# Altium schematic sheet 02_Block diagram.SchDoc
size A3; SheetNumber: 2; SheetTotal: 4
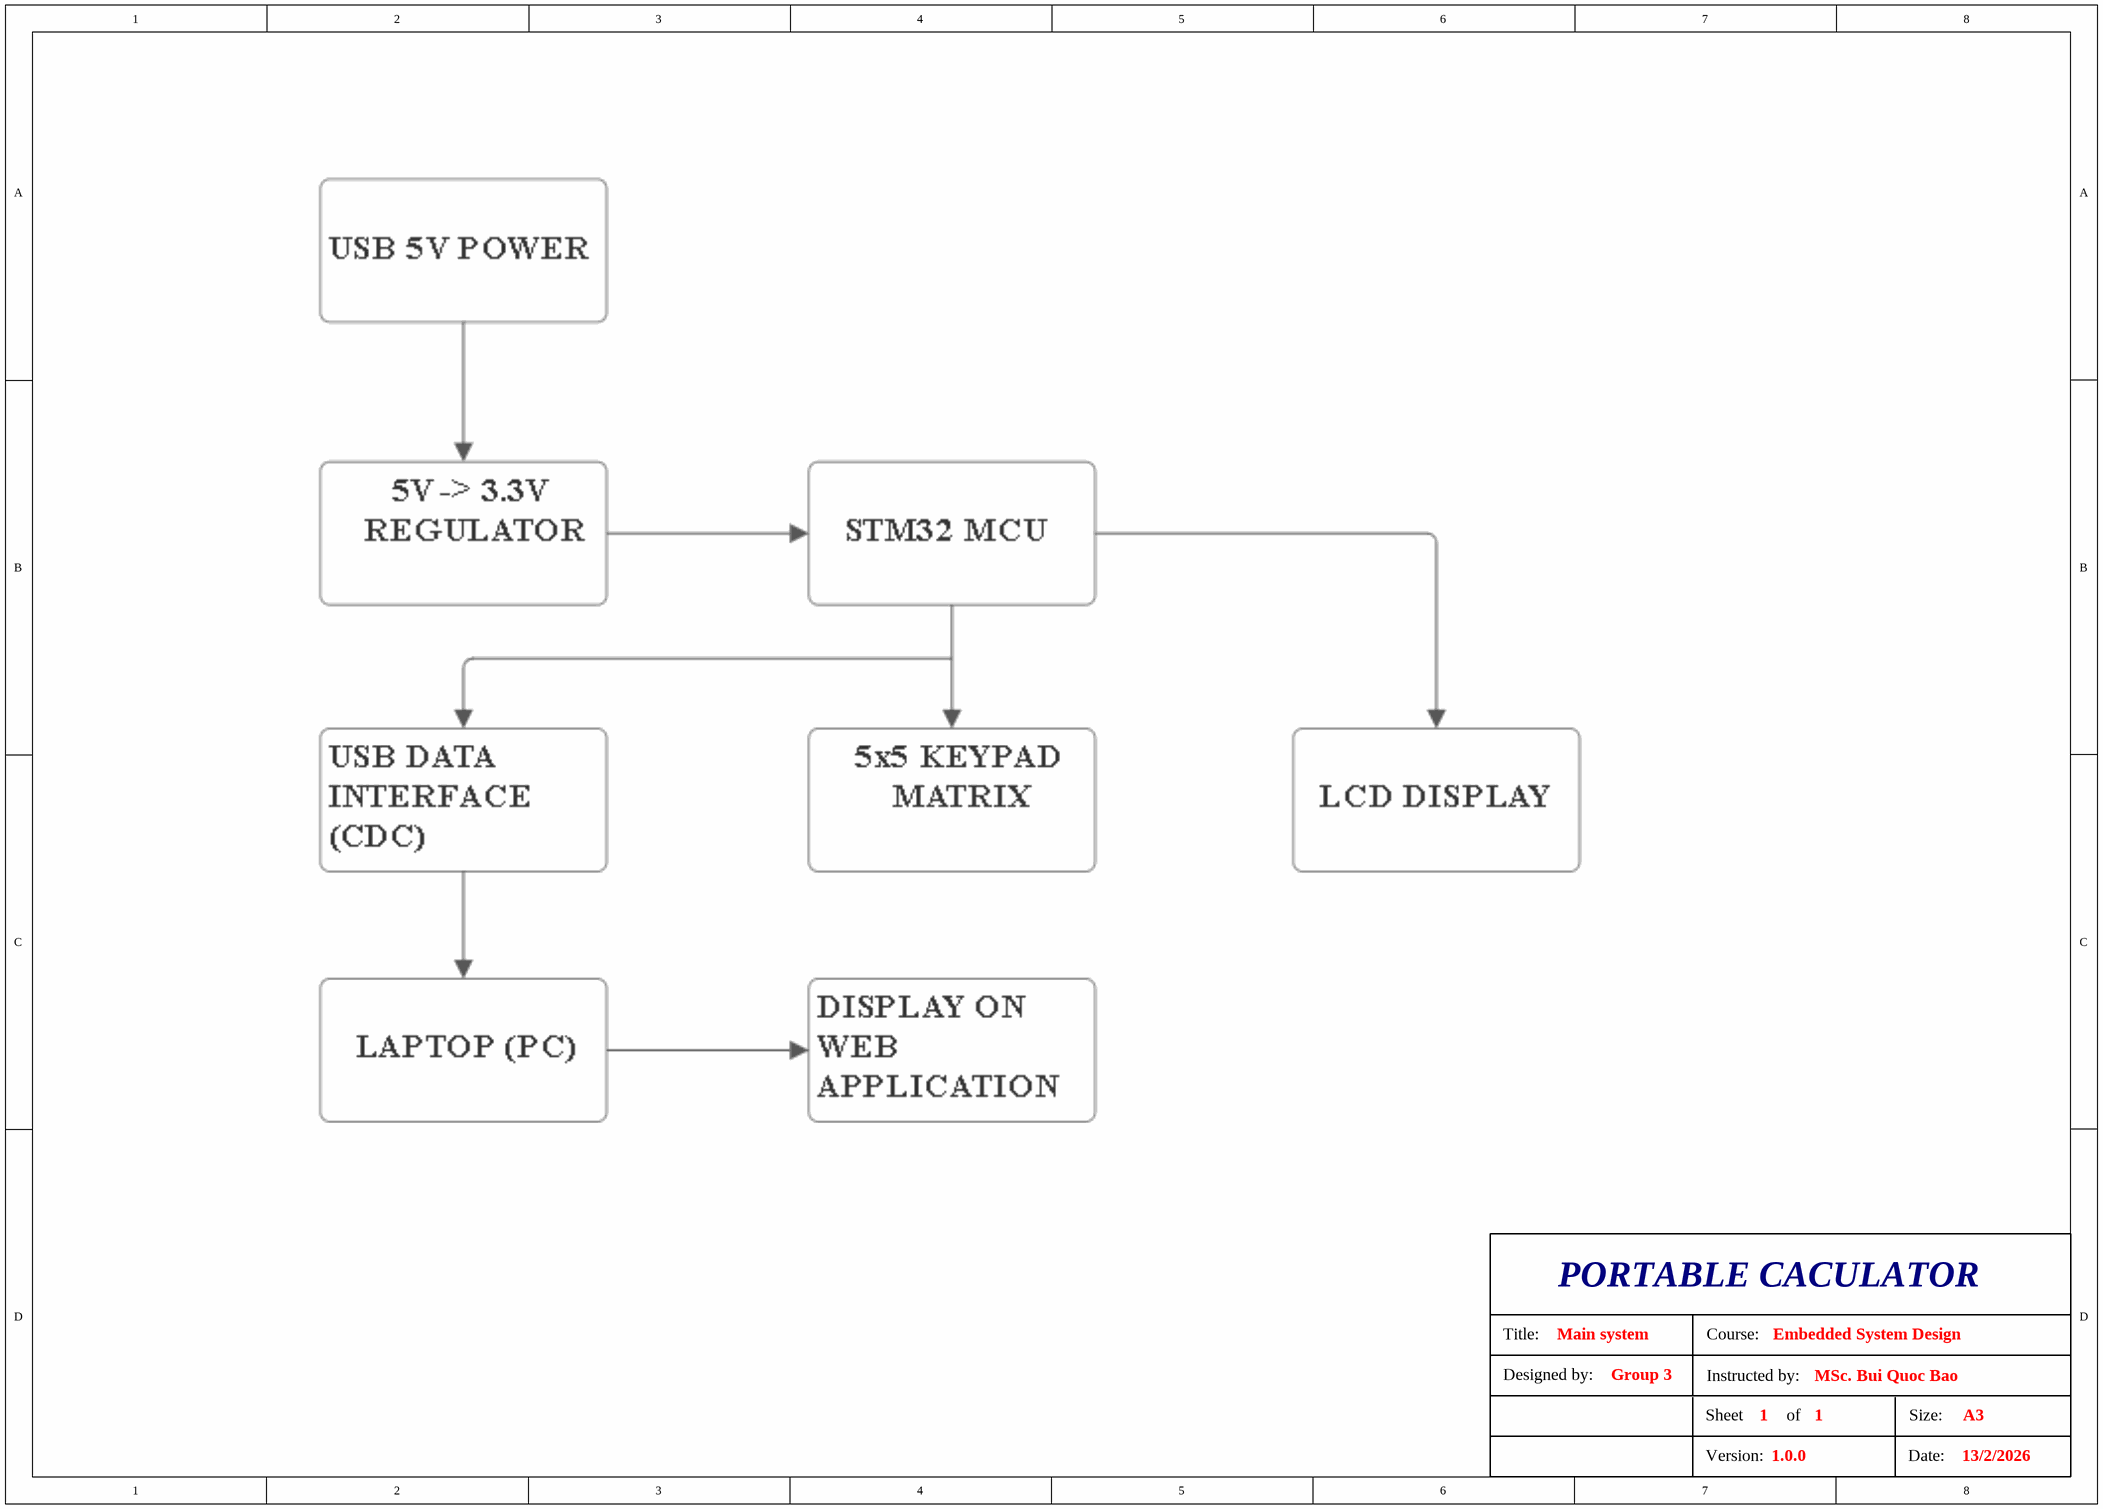
[diagram p0: 02_Block diagram.SchDoc]

## Notes on the sheet
- PORTABLE CACULATOR
- Designed by:
- Title:
- Main system
- Group 3
- Instructed by:
- Course:
- Embedded System Design
- MSc. Bui Quoc Bao
- Version:
- Sheet
- 1
- 1.0.0
- of
- Date:
- Size:
- 13/2/2026
- A3